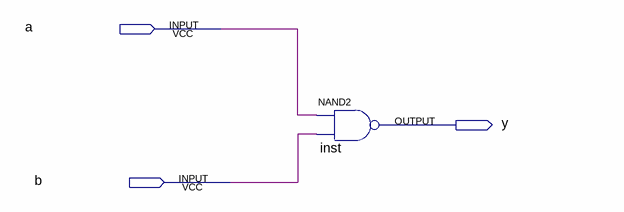
[diagram p0: schematic sheet]
// Quartus schematic yufei.bdf as structural Verilog: 1 symbols, 3 pins
module yufei (
  input  a,
  input  b,
  output y
);

  nand inst (y, a, b);
endmodule
